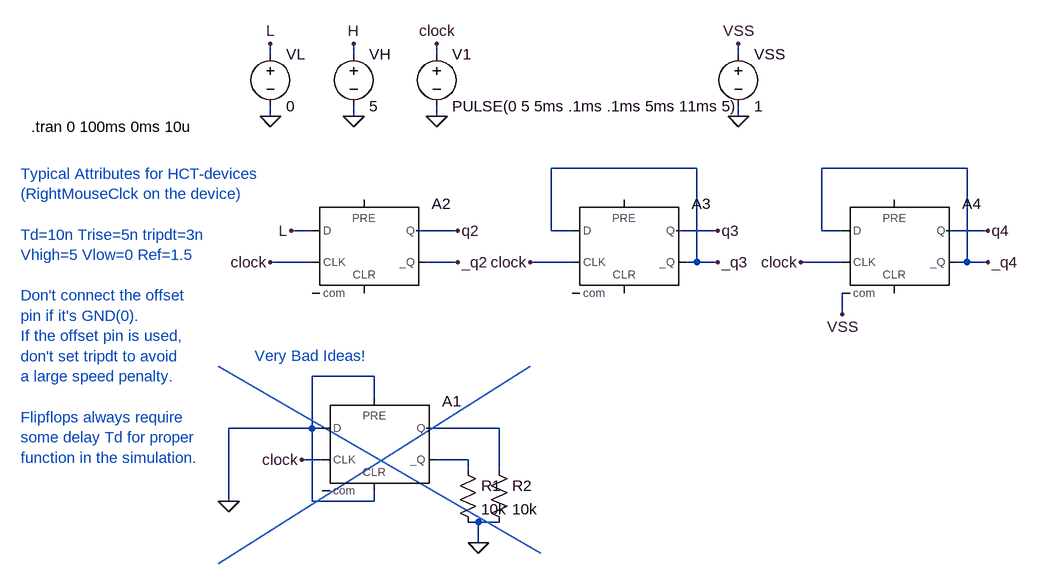
[diagram p0: schematic dflop1.asc]
dflop1.asc, the LTspice schematic file:
Version 4
SHEET 1 1548 900
WIRE 384 -128 384 -144
WIRE 512 -128 512 -144
WIRE 640 -128 640 -144
WIRE 1104 -128 1104 -144
WIRE 384 -32 384 -48
WIRE 512 -32 512 -48
WIRE 640 -32 640 -48
WIRE 1104 -32 1104 -48
WIRE 1040 48 816 48
WIRE 1456 48 1232 48
WIRE 448 144 416 144
WIRE 672 144 608 144
WIRE 816 144 816 48
WIRE 848 144 816 144
WIRE 1072 144 1008 144
WIRE 1232 144 1232 48
WIRE 1264 144 1232 144
WIRE 1488 144 1424 144
WIRE 448 192 384 192
WIRE 672 192 624 192
WIRE 848 192 784 192
WIRE 1040 192 1040 48
WIRE 1040 192 1024 192
WIRE 1072 192 1040 192
WIRE 1264 192 1200 192
WIRE 1456 192 1456 48
WIRE 1456 192 1440 192
WIRE 1488 192 1456 192
WIRE 1264 272 1264 240
WIRE 544 368 448 368
WIRE 544 400 544 368
WIRE 448 448 448 368
WIRE 448 448 320 448
WIRE 464 448 448 448
WIRE 736 448 624 448
WIRE 464 496 432 496
WIRE 688 496 640 496
WIRE 688 512 688 496
WIRE 736 512 736 448
WIRE 320 560 320 448
WIRE 448 560 448 448
WIRE 544 560 544 544
WIRE 544 560 448 560
WIRE 704 592 688 592
WIRE 736 592 704 592
WIRE 704 624 704 592
FLAG 704 624 0
FLAG 320 560 0
FLAG 432 496 clock
FLAG 384 192 clock
FLAG 384 -32 0
FLAG 512 -32 0
FLAG 384 -144 L
FLAG 512 -144 H
FLAG 416 144 L
FLAG 640 -32 0
FLAG 640 -144 clock
FLAG 784 192 clock
FLAG 1200 192 clock
FLAG 1104 -32 0
FLAG 1104 -144 VSS
FLAG 672 144 q2
FLAG 1072 144 q3
FLAG 1488 144 q4
FLAG 672 192 _q2
FLAG 1072 192 _q3
FLAG 1488 192 _q4
FLAG 1264 272 VSS
SYMBOL Digital\\dflop 544 400 R0
SYMATTR InstName A1
SYMBOL res 672 496 R0
SYMATTR InstName R1
SYMATTR Value 10k
SYMBOL res 720 496 R0
SYMATTR InstName R2
SYMATTR Value 10k
SYMBOL Digital\\dflop 528 96 R0
SYMATTR InstName A2
SYMATTR Value2 Td=10n Trise=5n tripdt=3n
SYMATTR SpiceLine Vhigh=5 Vlow=0 Ref=1.5
SYMBOL voltage 384 -144 R0
SYMATTR InstName VL
SYMATTR Value 0
SYMBOL voltage 512 -144 R0
SYMATTR InstName VH
SYMATTR Value 5
SYMBOL voltage 640 -144 R0
WINDOW 123 0 0 Left 0
WINDOW 39 0 0 Left 0
SYMATTR InstName V1
SYMATTR Value PULSE(0 5 5ms .1ms .1ms 5ms 11ms 5)
SYMBOL Digital\\dflop 928 96 R0
SYMATTR InstName A3
SYMATTR Value2 Td=10n Trise=5n tripdt=3n
SYMATTR SpiceLine Vhigh=5 Vlow=0 Ref=1.5
SYMBOL Digital\\dflop 1344 96 R0
SYMATTR InstName A4
SYMATTR Value2 Td=10n Trise=5n
SYMATTR SpiceLine Vhigh=5 Vlow=0 Ref=1.5
SYMBOL voltage 1104 -144 R0
SYMATTR InstName VSS
SYMATTR Value 1
TEXT 16 -16 Left 0 !.tran 0 100ms 0ms 10u
TEXT 0 56 Left 0 ;Typical Attributes for HCT-devices\n(RightMouseClck on the device)\n \nTd=10n Trise=5n tripdt=3n\nVhigh=5 Vlow=0 Ref=1.5\n \nDon't connect the offset\npin if it's GND(0).\nIf the offset pin is used, \ndon't set tripdt to avoid \na large speed penalty.\n \nFlipflops always require \nsome delay Td for proper\nfunction in the simulation.
TEXT 360 336 Left 0 ;Very Bad Ideas!
LINE Normal 784 352 304 656
LINE Normal 784 352 784 352
LINE Normal 784 352 784 352
LINE Normal 784 352 784 352
LINE Normal 784 352 784 352
LINE Normal 784 352 784 352
LINE Normal 784 352 784 352
LINE Normal 784 352 784 352
LINE Normal 800 640 304 352
LINE Normal 800 640 800 640

The netlist it stands for:
* dflop1.asc
A1 0 0 clock 0 0 N002 N001 0 DFLOP
R1 N002 0 10k
R2 N001 0 10k
A2 L 0 clock 0 0 _q2 q2 0 DFLOP Td=10n Trise=5n tripdt=3n Vhigh=5 Vlow=0 Ref=1.5
VL L 0 0
VH H 0 5
V1 clock 0 PULSE(0 5 5ms .1ms .1ms 5ms 11ms 5)
A3 _q3 0 clock 0 0 _q3 q3 0 DFLOP Td=10n Trise=5n tripdt=3n Vhigh=5 Vlow=0 Ref=1.5
A4 _q4 VSS clock VSS VSS _q4 q4 VSS DFLOP Td=10n Trise=5n Vhigh=5 Vlow=0 Ref=1.5
VSS VSS 0 1
.tran 0 100ms 0ms 10u
* Typical Attributes for HCT-devices
* (RightMouseClck on the device)
* Td=10n Trise=5n tripdt=3n
* Vhigh=5 Vlow=0 Ref=1.5
* Don't connect the offset
* pin if it's GND(0).
* If the offset pin is used,
* don't set tripdt to avoid
* a large speed penalty.
* Flipflops always require
* some delay Td for proper
* function in the simulation.
* Very Bad Ideas!
.backanno
.end